# Altium project Encoder.PrjPcb
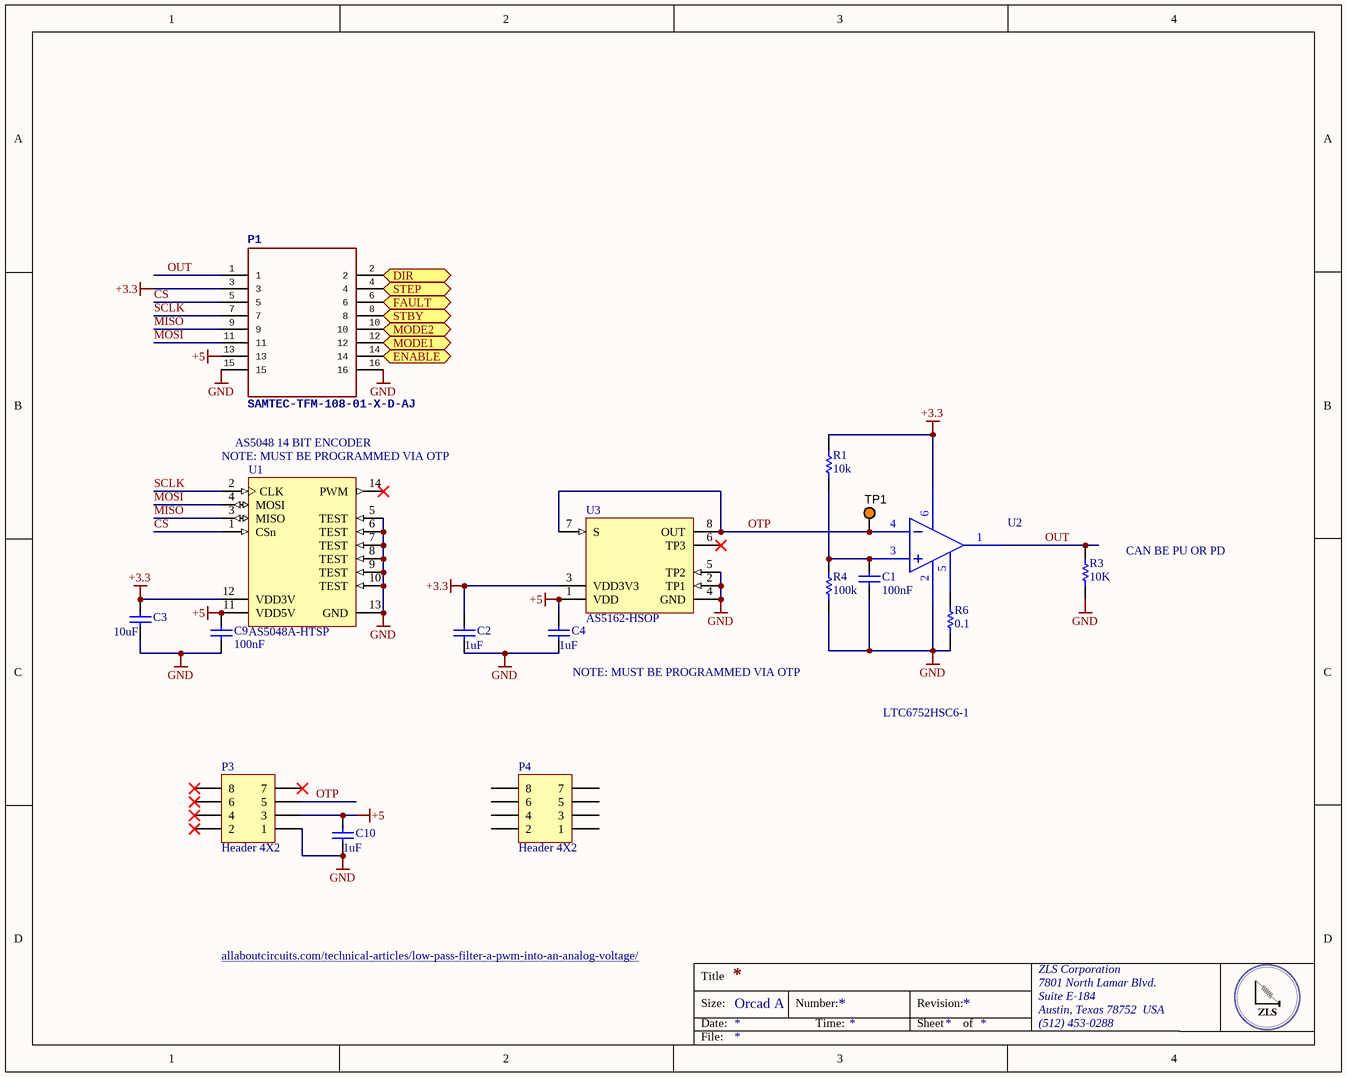
[diagram p0: Encoders.SchDoc]
2 sheets, 30 parts. Net scope: flat (ports and power ports of the same name join across sheets).
Board file: Encoder.PcbDoc
Sheets:
  Encoders.SchDoc
  Motor.SchDoc

## Sheet Encoders.SchDoc
size OrCAD A

### Parts
C1  Capacitance: 100nF  [CAPC2013X135X50ML15T20]  (hidden comment: VJ0805Y104KXXCW1BC)
C2  1uF  [CAPC2013X135X50ML15T20]
C3  10uF  [CAPC2013X135X50ML15T20]
C4  1uF  [CAPC2013X135X50ML15T20]
C9  Capacitance: 100nF  [CAPC2013X135X50ML15T20]  (hidden comment: VJ0805Y104KXXCW1BC)
C10  1uF  [CAPC2013X135X50ML15T20]
P1  SAMTEC-TFM-108-01-X-D-AJ  [SAMTEC-TFM-108-01-X-D-A]
P3  Header 4X2  [HDR2X4]
P4  Header 4X2  [HDR2X4]
R1  10k  [RESC0603(1608)_N]
R3  10K  [RESC0603(1608)_N]
R4  100k  [RESC0603(1608)_N]
R6  0.1  [RESC0603(1608)_N]
TP1  5003  [KSTN-5003]  (value not drawn)
U1  AS5048A-HTSP  [AMS-TSSOP-14-5000X4400DE_L]
U2  LTC6752HSC6-1TRMPBF  (value not drawn)
U3  AS5162-HSOP  [AMS-SOIC-8-4900X3900DE_M]

### Ports
DIR, ENABLE, FAULT, MODE1, MODE2, STBY, STEP

### Nets
+3.3: C2.2 C3.2 P1.3 R1.2 U1.12(VDD3V) U2.6(V+) U3.3(VDD3V3)
+5: C4.2 C9.2 C10.2 P1.13 P3.3 U1.11(VDD5V) U3.1(VDD)
GND: C1.1 C2.1 C3.1 C4.1 C9.1 C10.1 P1.15 P1.16 P3.1 R3.1 R4.1 R6.1 U1.5(TEST) U1.6(TEST) U1.7(TEST) U1.8(TEST) U1.9(TEST) U1.10(TEST) U1.13(GND) U2.2(V-) U3.2(TP1) U3.4(GND) U3.5(TP2)
CS: P1.5 U1.1(CSn)
MISO: P1.9 U1.3(MISO)
MOSI: P1.11 U1.4(MOSI)
OTP: P3.5 TP1.1 U2.4(-IN) U3.7(S) U3.8(OUT)
OUT: P1.1 R3.2 U2.1(OUT)
SCLK: P1.7 U1.2(CLK)
NetC1_2: C1.2 R1.1 R4.2 U2.3(+IN)
NetC7_2: P1.6 ; port FAULT
NetP1_2: P1.2 ; port DIR
NetP1_4: P1.4 ; port STEP
NetP1_8: P1.8 ; port STBY
NetP1_10: P1.10 ; port MODE2
NetP1_12: P1.12 ; port MODE1
NetP1_14: P1.14 ; port ENABLE
NetR6_2: R6.2 U2.5(HYS)

Not connected (* = marked no-connect by the designer): P3 2* 4* 6* 7* 8*; P4 1 2 3 4 5 6 7 8; U1 14(PWM)*; U3 6(TP3)*

### Notes on the sheet
- (near U1) NOTE: MUST BE PROGRAMMED VIA OTP
- (near U1) AS5048 14 BIT ENCODER
- (near R3) CAN BE PU OR PD
- (near C4) NOTE: MUST BE PROGRAMMED VIA OTP
- LTC6752HSC6-1
- allaboutcircuits.com/technical-articles/low-pass-filter-a-pwm-into-an-analog-voltage/
- Title
- Size:
- Date:
- Orcad A
- Number:
- Time:
- Revision:
- Sheet
- of
- ZLS Corporation
- 7801 North Lamar Blvd.
- Suite E-184
- Austin, Texas 78752  USA
- (512) 453-0288
- File:

### Library data of the parts
C1 C9 = CMP-2007-03442-1: 0.1µF ±10% 25V Ceramic Capacitor X7R 0805 (2012 Metric); Manufacturer: Vitramon; Dielectric Material: Tantalum; Part Number: VJ0805Y104KXXCW1BC; Supplier 1: Digi-Key; Supplier Part Number 1: 720-1537-1-ND; Manufacturer Part Number: VJ0805Y104KXXCW1BC; Stock 1: 72674; Pricing 1: 1=0.26000, 10=0.17900, 100=0.10120, 500=0.07142, 1000=0.06250 (USD); RoHS: Yes; Mount: Surface Mount; Case/Package: 0805; Number of Pins: 2; Weight: 0.000194oz; Case Code (Imperial): 0805; Case Code (Metric): 2012; Min Operating Temperature: -55°C; Max Operating Temperature: 125°C; Tolerance: 10%; Packaging: Tape and Reel; Voltage Rating: 25V; Dielectric: X7R; Package Quantity: 4000; Voltage Rating (DC): 25V; Termination: SMD/SMT; Length: 2mm; Height: 1.45mm; Width: 1.25mm; Thickness: 0.037inch; Depth: 1.25mm; Lead Free: Lead Free; ComponentLink1URL: https://datasheet.ciiva.com/11491/vjw1bcbascomseries-11491758.pdf?src-supplier=Avnet; ComponentLink1Description: https://datasheet.ciiva.com/11491/vjw1bcbascomseries-11491758.pdf?src-supplier=Avnet; ComponentLink2URL: https://datasheet.ciiva.com/176/vjw1bcbascomseries-176875.pdf?src-supplier=Digi-Key; ComponentLink2Description: https://datasheet.ciiva.com/176/vjw1bcbascomseries-176875.pdf?src-supplier=Digi-Key
C2-C4 C10 = CMP-2007-03442-1: 0.1µF ±10% 25V Ceramic Capacitor X7R 0805 (2012 Metric)
P3 P4 = Header 4X2: Header, 4-Pin, Dual row; LatestRevisionDate: 17-Jul-2002; LatestRevisionNote: Re-released for DXP Platform.; Publisher: Altium Limited
R1 R4 = CMP-1012-00511-1: 0R12 0.1W 1% 0603 (1608 Metric)  SMD
R3 R6 = CMP-1012-00511-1: 0R12 0.1W 1% 0603 (1608 Metric)  SMD; Manufacturer: Vishay; Manufacturer Part Number: CRCW060310K0FKEA; Value: 1020.00 Ohm; Case-EIA: 0603; Case-Metric: 1608; Resistance: 10kR; Power Rating: 100mW; Voltage Rating: 75V; Temperature Coefficient: 100ppm/°C; Technology: SMT; Power: 0.1 W; Tolerance: 1 %; Supplier 1: Digi-Key; Supplier Part Number 1: 311-0.0GRDKR-ND; Stock 1: 49641653; Pricing 1: 1=0.1, 10=0.021, 25=0.0152, 50=0.0114, 100=0.0084, 250=0.00644, 500=0.00514, 1000=0.00379 (USD); Case/Package: 0603; Number of Pins: 2; Weight: 7.1E-05oz; Case Code (Metric): 1608; Case Code (Imperial): 0603; Contact Plating: Lead,Tin; Min Operating Temperature: -55°C; Max Operating Temperature: 155°C; Packaging: Tape and Reel; Package Quantity: 10; Composition: Thick Film; Military Standard: Not; Termination: SMD/SMT; Voltage Rating (DC): 75V; Number of Terminations: 2; Max Power Dissipation: 100mW; Features: Automotive AEC-Q200; Length: 1.55mm; Height: 0.45mm; Width: 0.033inch; Depth: 0.85mm; Radiation Hardening: No; REACH SVHC: Unknown; Lead Free: Lead Free; ComponentLink1URL: http://www.vishay.com/docs/20008/dcrcw.pdf; ComponentLink1Description: http://www.vishay.com/docs/20008/dcrcw.pdf; ComponentLink2URL: https://www.verical.com/server-webapp/html/getDatasheet?partID=86831; ComponentLink2Description: https://www.verical.com/server-webapp/html/getDatasheet?partID=86831; ComponentLink3URL: http://www.farnell.com/datasheets/2310790.pdf; ComponentLink3Description: http://www.farnell.com/datasheets/2310790.pdf; ComponentLink4URL: http://www.vishay.com/docs/20035/dcrcwe3.pdf; ComponentLink4Description: http://www.vishay.com/docs/20035/dcrcwe3.pdf; ComponentLink5URL: http://www.farnell.com/datasheets/2111203.pdf; ComponentLink5Description: http://www.farnell.com/datasheets/2111203.pdf; ComponentLink6URL: http://uk.rs-online.com/webdocs/0d98/0900766b80d98afc.pdf; ComponentLink6Description: http://uk.rs-online.com/webdocs/0d98/0900766b80d98afc.pdf
TP1 = CMP-1672-00009-1: Test Point, Orange, 1-Pin THD, RoHS; Peak Reverse Current: 600 uA; Forward Current: 3 A; Max Surge Current: 80 A; Forward Voltage: 1.08 V; Max Operating Temperature: 150 degC; PackageReference: 5003; Pins: 2; ComponentLink2URL: http://keyelco.com/userAssets/file/M65p56.pdf; PackageDescription: 1-Pin Through Hole Device, Dia 2.54 mm; Weight: 0.01 lb; Diameter: 5.3 mm; Mount: Through Hole; Package Quantity: 500; Packaging: Bulk; Min Operating Temperature: -65 degC; ComponentLink1Description: Manufacturer URL; Height: 0.25 inch; ComponentLink1URL: http://www.keyelco.com/; ComponentLink2Description: Datasheet; Width: 0.25 inch; REACH SVHC: No SVHC; RoHSCompliant: true; Radiation Hardening: No; Length: 9.5 mm; DatasheetVersion: Jun-15
U1 = CMP-0555-00034-2: Magnetic Rotary Encoder 14-bit Angular Position Sensor, 3.3 or 5 V, TSSOP-14, Pb-Free, Reel; Manufacturer: AMS; Supply Voltage (V): 3.3 or 5.0; Output: SPI, PWM; ComponentLink2URL: http://www.ams.com/eng/content/download/438523/1341157/143015; Mounting Technology: Surface Mount; PackageDescription: 14-Pin Small Outline Package, 5 x 4.4 mm Body, 0.65 mm Pitch; Resolution: 14-bit; ComponentLink1URL: www.ams.com; DatasheetVersion: Rev. 1.3; Features: SPI, PWM, In System Programmable; PartNumber: AS5048A-HTSP; Code_JEDEC: MO-153; PackageReference: TSSOP-14; PackageVersion: Rev. 2.7, 10/2010; ComponentLink1Description: Manufacturer URL; ComponentLink2Description: Datasheet
U2 = LTC6752HSC6-1TRMPBF: IC COMP R-R CMOS 280MHZ SC70-6
U3 = CMP-0555-00008-2: 12-Bit Magnetic Angle Position Sensor, 4.5 to 5.5 V, SOIC-8, Pb-Free, Reel; Manufacturer: AMS; ComponentLink1URL: www.ams.com; Code_JEDEC: MS-012; ComponentLink1Description: Manufacturer URL; DatasheetVersion: Rev. 1.3; ComponentLink2Description: Datasheet; PackageReference: SOIC-8; PackageVersion: N/C, 09/2010; ComponentLink2URL: http://www.ams.com/eng/content/download/326803/1143657/185575; Mounting Technology: Surface Mount; Packing: Reel; PartNumber: AS5162-HSOP; PackageDescription: 8-Pin Small Outline Integrated Circuit, 4.9 x 3.9 mm Body, 1.27 mm Pitch

## Sheet Motor.SchDoc
size OrCAD A
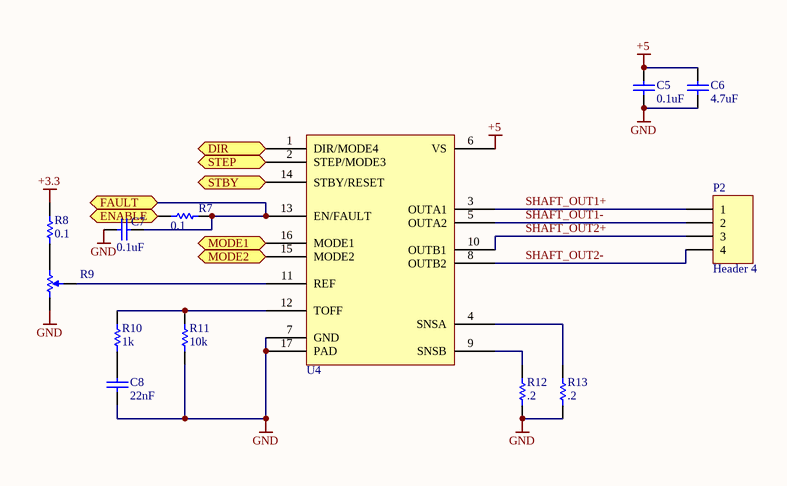
[diagram p1: Motor.SchDoc]

### Parts
C5  0.1uF  [CAPC1608X94X35LL15T15]
C6  4.7uF  [CAPC0603(1608)55_M]
C7  0.1uF  [CAPC1608X94X35LL15T15]
C8  22nF  [CAPC1608X94X35LL15T15]
P2  Header 4  [HDR1X4]
R7  0.1  [RESC0603(1608)_N]
R8  0.1  [RESC0603(1608)_N]
R9  3313J-1-503E  [BOUR-3313J-1_V]  (value not drawn)
R10  1k  [RESC0603(1608)_N]
R11  10k  [RESC0603(1608)_N]
R12  .2  [RESC0603(1608)_N]
R13  .2  [RESC0603(1608)_N]
U4  STSPIN220  [STSPIN220-QFN127P600-8N]  (value not drawn)

### Ports
DIR, ENABLE, FAULT, MODE1, MODE2, STBY, STEP

### Nets
+3.3: R8.2
+5: C5.1 C6.2 U4.6(VS)
GND: C5.2 C6.1 C7.1 C8.2 R9.1 R11.1 R12.1 R13.1 U4.7(GND) U4.17(PAD)
SHAFT_OUT1+: P2.1 U4.3(OUTA1)
SHAFT_OUT1-: P2.2 U4.5(OUTA2)
SHAFT_OUT2+: P2.3 U4.10(OUTB1)
SHAFT_OUT2-: P2.4 U4.8(OUTB2)
NetC7_2: C7.2 R7.1 U4.13(EN/FAULT) ; port FAULT
NetC8_1: C8.1 R10.1
NetP1_2: U4.1(DIR/MODE4) ; port DIR
NetP1_4: U4.2(STEP/MODE3) ; port STEP
NetP1_8: U4.14(STBY/RESET) ; port STBY
NetP1_10: U4.15(MODE2) ; port MODE2
NetP1_12: U4.16(MODE1) ; port MODE1
NetP1_14: R7.2 ; port ENABLE
NetR8_1: R8.1 R9.3
NetR9_2: R9.2 U4.11(REF)
NetR10_2: R10.2 R11.2 U4.12(TOFF)
NetR12_2: R12.2 U4.9(SNSB)
NetR13_2: R13.2 U4.4(SNSA)

### Notes on the sheet
- Title
- Size:
- Date:
- Orcad A
- Number:
- Time:
- Revision:
- Sheet
- of
- ZLS Corporation
- 7801 North Lamar Blvd.
- Suite E-184
- Austin, Texas 78752  USA
- (512) 453-0288
- File:

### Library data of the parts
C5 C7 C8 = CMP-1661-00001-2: CAP .1UF 16V CERAMIC X7R 0603; Manufacturer: Yageo; Manufacturer Part Number: CC0603KRX7R7BB105; Capacitance: 1uF; Tolerance: 10%; Dissipation Factor: 5%; ComponentLink1Description: Datasheet; ComponentLink1URL: http://datasheets.avx.com/X7RDielectric.pdf; Supplier 1: Digi-Key; Supplier Part Number 1: 311-1446-6-ND; Stock 1: 5506121; Pricing 1: 1=0.21, 10=0.143, 100=0.0727, 500=0.04974, 1000=0.044 (USD); Mount: Surface Mount; Case/Package: 0603; Number of Pins: 2; Case Code (Metric): 1608; Case Code (Imperial): 0603; Min Operating Temperature: -55°C; Max Operating Temperature: 125°C; Voltage Rating: 16V; Package Quantity: 1; Packaging: Tape and Reel; Voltage Rating (DC): 16V; Dielectric: X7R; Termination: SMD/SMT; Voltage: 16V; Composition: Ceramic; Length: 1.6mm; Height: 0.8mm; Width: 0.031inch; Thickness: 0.035inch; Depth: 0.8mm; Radiation Hardening: No; REACH SVHC: Unknown; Lead Free: Lead Free; Halogen Free: Halogen Free; ComponentLink2URL: http://www.yageo.com/documents/recent/UPY-GPHC_X7R_6.3V-to-50V_18.pdf; ComponentLink2Description: http://www.yageo.com/documents/recent/UPY-GPHC_X7R_6.3V-to-50V_18.pdf; ComponentLink3URL: http://www.yageo.com/documents/recent/UPY-GPHC_X7R_6.3V-to-50V_8.pdf; ComponentLink3Description: http://www.yageo.com/documents/recent/UPY-GPHC_X7R_6.3V-to-50V_8.pdf; ComponentLink4URL: http://www.farnell.com/datasheets/1734573.pdf; ComponentLink4Description: http://www.farnell.com/datasheets/1734573.pdf; ComponentLink5URL: http://www.farnell.com/datasheets/1489800.pdf; ComponentLink5Description: http://www.farnell.com/datasheets/1489800.pdf
C6 = CMP-1035-02779-1: CAP 4.7uF 6.3V ±10% 0603 (1608 Metric) Thickness 0.55mm SMD; Manufacturer: KEMET; Manufacturer Part Number: C0603C475K9PACTU; Case-EIA: 0603; Tolerance: Â±10%; Case-Metric: 1608; Dielectric Material: Ceramic; Dielectric: X5R; Dissipation Factor: 5%; Technology: SMT; Value: 4.7uF; Max Thickness: 0.55 mm; Rated Voltage: 6.3 V; Supplier 1: Digi-Key; Supplier Part Number 1: 399-3482-6-ND; Stock 1: 1765509; Pricing 1: 1=0.21, 10=0.15, 100=0.0706, 500=0.04952, 1000=0.041 (USD); Mount: PCB,Surface Mount; Case/Package: 0603; Number of Pins: 2; Case Code (Metric): 1608; Case Code (Imperial): 0603; Contact Plating: Matte,Tin; Min Operating Temperature: -55°C; Max Operating Temperature: 85°C; Package Quantity: 1; Capacitance: 4.7uF; Voltage Rating: 6.3V; Packaging: Tape and Reel; Termination: SMD/SMT; Voltage Rating (DC): 6.3V; Voltage: 6.3V; Length: 1.6mm; Height: 0.8mm; Width: 0.031inch; Thickness: 0.035inch; Depth: 0.8mm; Lead Pitch: 0.7mm; Radiation Hardening: No; Lead Free: Lead Free; REACH SVHC: No SVHC; ComponentLink1URL: https://api.kemet.com/component-edge/download/datasheet/C0603C475K9PACTU.pdf; ComponentLink1Description: https://api.kemet.com/component-edge/download/datasheet/C0603C475K9PACTU.pdf; ComponentLink2URL: http://www.farnell.com/datasheets/1732700.pdf; ComponentLink2Description: http://www.farnell.com/datasheets/1732700.pdf; ComponentLink3URL: http://www.farnell.com/datasheets/1789732.pdf; ComponentLink3Description: http://www.farnell.com/datasheets/1789732.pdf; ComponentLink4URL: http://www.farnell.com/datasheets/40889.pdf; ComponentLink4Description: http://www.farnell.com/datasheets/40889.pdf
P2 = Header 4: Header, 4-Pin; LatestRevisionDate: 17-Jul-2002; LatestRevisionNote: Re-released for DXP Platform.; Publisher: Altium Limited
R7 R8 R10-R13 = CMP-1012-00511-1: as R3 on sheet Encoders; Technology: SMT; Power: 0.1 W; Tolerance: 1 %; Supplier 1: Digi-Key; Supplier Part Number 1: 311-0.0GRDKR-ND; Stock 1: 49641653; Pricing 1: 1=0.1, 10=0.021, 25=0.0152, 50=0.0114, 100=0.0084, 250=0.00644, 500=0.00514, 1000=0.00379 (USD); Case/Package: 0603; Number of Pins: 2; Weight: 7.1E-05oz; Case Code (Metric): 1608; Case Code (Imperial): 0603; Contact Plating: Lead,Tin; Min Operating Temperature: -55°C; Max Operating Temperature: 155°C; Packaging: Tape and Reel; Package Quantity: 10; Composition: Thick Film; Military Standard: Not; Termination: SMD/SMT; Voltage Rating (DC): 75V; Number of Terminations: 2; Max Power Dissipation: 100mW; Features: Automotive AEC-Q200; Length: 1.55mm; Height: 0.45mm; Width: 0.033inch; Depth: 0.85mm; Radiation Hardening: No; REACH SVHC: Unknown; Lead Free: Lead Free; ComponentLink1URL: http://www.vishay.com/docs/20008/dcrcw.pdf; ComponentLink1Description: http://www.vishay.com/docs/20008/dcrcw.pdf; ComponentLink2URL: https://www.verical.com/server-webapp/html/getDatasheet?partID=86831; ComponentLink2Description: https://www.verical.com/server-webapp/html/getDatasheet?partID=86831; ComponentLink3URL: http://www.farnell.com/datasheets/2310790.pdf; ComponentLink3Description: http://www.farnell.com/datasheets/2310790.pdf; ComponentLink4URL: http://www.vishay.com/docs/20035/dcrcwe3.pdf; ComponentLink4Description: http://www.vishay.com/docs/20035/dcrcwe3.pdf; ComponentLink5URL: http://www.farnell.com/datasheets/2111203.pdf; ComponentLink5Description: http://www.farnell.com/datasheets/2111203.pdf; ComponentLink6URL: http://uk.rs-online.com/webdocs/0d98/0900766b80d98afc.pdf; ComponentLink6Description: http://uk.rs-online.com/webdocs/0d98/0900766b80d98afc.pdf
R9 = CMP-2000-05588-1: 3 mm Trimpot(R) Trimming Potentiometer, 50 KOhm, +/- 20%, 0.125 W, -55 to 125 degC, 3-Pin SMD, RoHS, Tape and Reel; Manufacturer: Bourns; SVHC: NoSVHC(19-Dec-2012); Temperature Coefficient: ±150ppm/°C; No. of Turns: 1; Power Rating: 125mW; Track Resistance: 50kohm; Manufacturer URL: http://www.bourns.com/; Potentiometer Mounting: SMD; Package Description: 3-Pin Surface Mount Device, Body 3.5 x 3.2 mm, Pitch 1.15 mm; Package Reference: 3313J-1; Mounting Technology: SurfaceMount; Resistance Tolerance: ±20%; Datasheet Version: 05/2016; Datasheet URL: http://www.bourns.com/docs/Product-Datasheets/3313.pdf

## Nets that join several sheets
+3.3: Encoders (7 pins), Motor (R8.2)
+5: Encoders (7 pins), Motor (C5.1 C6.2 U4.6)
GND: Encoders (23 pins), Motor (10 pins)
NetC7_2: Encoders (P1.6), Motor (C7.2 R7.1 U4.13)
NetP1_2: Encoders (P1.2), Motor (U4.1)
NetP1_4: Encoders (P1.4), Motor (U4.2)
NetP1_8: Encoders (P1.8), Motor (U4.14)
NetP1_10: Encoders (P1.10), Motor (U4.15)
NetP1_12: Encoders (P1.12), Motor (U4.16)
NetP1_14: Encoders (P1.14), Motor (R7.2)